# EasyEDA Pro project 编码电子锁.eprj

# Schematic Schematic1
Create Date: 2025-03-08; Page Name: P1; Project Name: 编码电子锁; Schematic Name: Schematic1; Update Date: 2025-03-08; Company: 嘉立创EDA; Page Size: A4; Version: V1.0
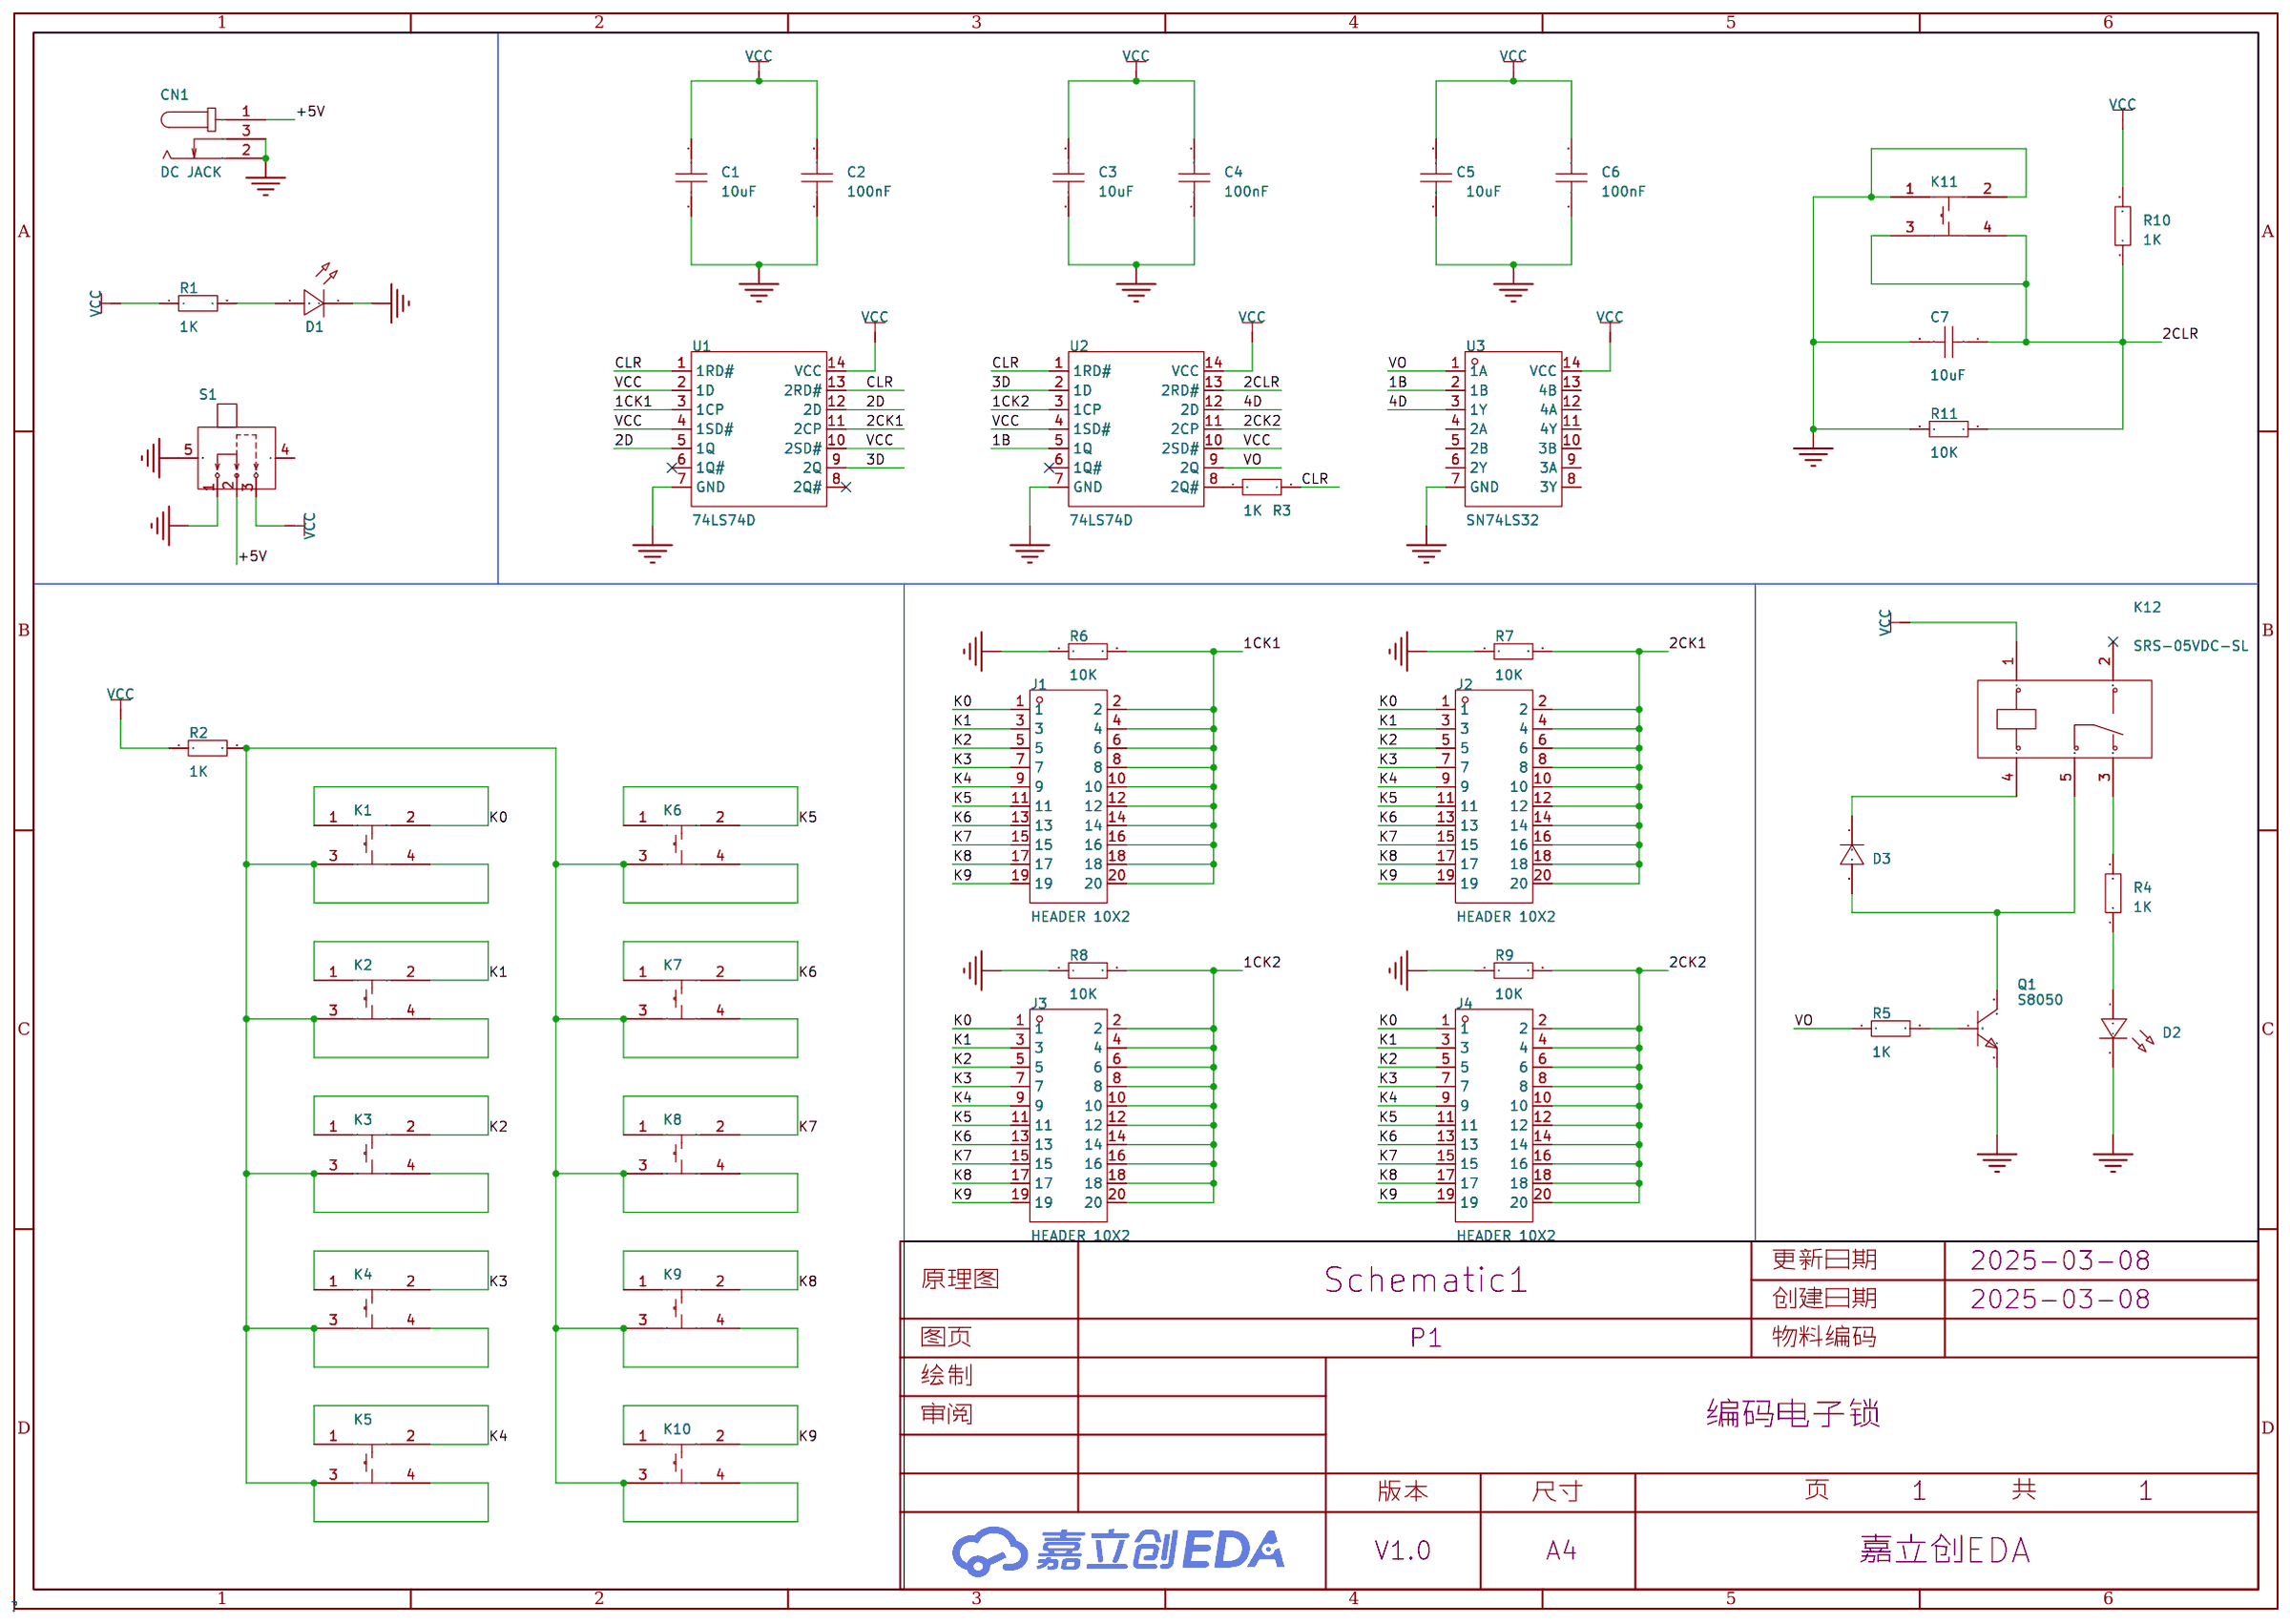
[diagram p0: schematic sheet]

## Parts
C1  10uF  [C0805]
C2  100nF  [C0805]
C3  10uF  [C0805]
C4  100nF  [C0805]
C5  10uF  [C0805]
C6  100nF  [C0805]
C7  10uF  [C0805]
CN1  DC JACK  [DC-IN-TH_DC005]
D1  -  [LED_TH-3mm]
D2  -  [LED_TH-3mm]
D3  LL4148-GS08  [SOD-80_L3.5-W1.5-RD]
J1  HEADER 10X2  [HDR-TH_20P-P2.54-V-M-R2-C10-S2.54]
J2  HEADER 10X2  [HDR-TH_20P-P2.54-V-M-R2-C10-S2.54]
J3  HEADER 10X2  [HDR-TH_20P-P2.54-V-M-R2-C10-S2.54]
J4  HEADER 10X2  [HDR-TH_20P-P2.54-V-M-R2-C10-S2.54]
K1  TS-1002S-04526C  [SW-SMD_4P-L6.0-W6.0-P4.50-LS9.0-2]
K2  TS-1002S-04526C  [SW-SMD_4P-L6.0-W6.0-P4.50-LS9.0-2]
K3  TS-1002S-04526C  [SW-SMD_4P-L6.0-W6.0-P4.50-LS9.0-2]
K4  TS-1002S-04526C  [SW-SMD_4P-L6.0-W6.0-P4.50-LS9.0-2]
K5  TS-1002S-04526C  [SW-SMD_4P-L6.0-W6.0-P4.50-LS9.0-2]
K6  TS-1002S-04526C  [SW-SMD_4P-L6.0-W6.0-P4.50-LS9.0-2]
K7  TS-1002S-04526C  [SW-SMD_4P-L6.0-W6.0-P4.50-LS9.0-2]
K8  TS-1002S-04526C  [SW-SMD_4P-L6.0-W6.0-P4.50-LS9.0-2]
K9  TS-1002S-04526C  [SW-SMD_4P-L6.0-W6.0-P4.50-LS9.0-2]
K10  TS-1002S-04526C  [SW-SMD_4P-L6.0-W6.0-P4.50-LS9.0-2]
K11  TS-1002S-04526C  [SW-SMD_4P-L6.0-W6.0-P4.50-LS9.0-2]
K12  SRS-05VDC-SL  [RELAY-TH_SRD-XXVDC-XL-C]
Q1  S8050  [SOT-23-3_L3.0-W1.7-P0.95-LS2.9-BR]
R1  1K  [R0805]
R2  1K  [R0805]
R3  1K  [R0805]
R4  1K  [R0805]
R5  1K  [R0805]
R6  10K  [R0805]
R7  10K  [R0805]
R8  10K  [R0805]
R9  10K  [R0805]
R10  1K  [R0805]
R11  10K  [R0805]
S1  SS12F44G5  [SW-TH_SHOU-HAN_SS12F44G4]
U1  74LS74D  [DIP-14_L19.1-W6.4-P2.54-LS7.6-BL]
U2  74LS74D  [DIP-14_L19.1-W6.4-P2.54-LS7.6-BL]
U3  SN74LS32  [PDIP-14_L19.6-W6.5-P2.54-LS7.9-BL]

## Library data of the parts
C1-C7 = CAP_0805: Supplier Footprint: 0805
CN1 = DC005: 连接器类型:DC电源插座;安装方式:弯插;触点内径:2mm;触点外径:6.3mm;额定电流:500mA;额定电压:30V;工作温度范围:-25℃~+70℃;; LCSC Part Name: DC电源插座 内径:2mm 外径:6.3mm; Supplier Part: C431533; Manufacturer: SHOU HAN(首韩); Supplier Footprint: 插件; Datasheet: https://atta.szlcsc.com/upload/public/pdf/source/20190925/C431533_4751811035784AC1D38EBC85F7905E99.pdf; Supplier: LCSC; Connector Type: DC电源插座; Mounting Style: 弯插; Inside Contact Diameter: 2mm; Outside Contact Diameter: 6.3mm; Current Rating (Max): 500mA; Voltage Rating (Max): 30V; Operating Temperature Range: -25℃~+70℃
D1 D2 = LED_TH-R_3mm: Supplier Footprint: 插件
D3 = LL4148-GS08: 二极管配置:-;正向压降(Vf):860mV@50mA;直流反向耐压(Vr):75V;平均整流电流(Io):300mA;功率:500mW;反向恢复时间(trr):8ns;; LCSC Part Name: 电压:75V 电流:300mA; Supplier Part: C68883; Manufacturer: VISHAY(威世); Supplier Footprint: MiniMELF; Datasheet: https://atta.szlcsc.com/upload/public/pdf/source/20160803/1470206543327.pdf; Supplier: LCSC; Forward Voltage (Vf@If): 860mV@50mA; Reverse Voltage (Vr): 75V; Average Rectified Current (Io): 300mA; Power Dissipation: 500mW; Reverse Leakage Current: 5uA@75V; Reverse Recovery Time (trr): 8ns
J1-J4 = 2.54-2*10: 插针结构:2x10P;间距:2.54mm;排数:双排;总PIN位数:20P;; Supplier Part: C5116480; Manufacturer: ZHOURI(洲日); Supplier Footprint: 插件,P=2.54mm; Datasheet: https://atta.szlcsc.com/upload/public/pdf/source/20220412/C6BEA3D643D1CE07163CD717B50927E0.pdf; Supplier: LCSC; Pin Structure: 2x10P; Pitch: 2.54mm; Number of Rows: 双排; Number of Pins: 20P
K1-K11 = TS-1002S-04526C: 电路结构:单刀单掷;按钮形状:圆形按钮;安装方式:立贴;开关长度:6mm;开关宽度:6mm;开关高度:4.5mm;触点电流:50mA;额定电压(DC):12V;带灯:-;机械寿命:-;; LCSC Part Name: 6*6*4.5mm 立贴 轻触开关; Supplier Part: C455109; Manufacturer: XUNPU(讯普); Supplier Footprint: SMD,6x6mm; Datasheet: https://atta.szlcsc.com/upload/public/pdf/source/20191118/C455126_F61E8FA1ED640FB1CE0B30B55DEB62E3.pdf; Supplier: LCSC; Circuit: 单刀单掷; Actuator Style: 圆形按钮; Mounting Style: 立贴; Switch Length: 6mm; Switch Width: 6mm; Switch Height: 4.5mm; Contact Current: 50mA; Voltage Rating (DC): 12V
K12 = SRD-05VDC-SL-C: 线圈电压:5V;触点形式:一组转换:1C(单刀双掷-转换);触点容量(电阻负载):-;最大切换电压:250V@AC;最大切换电流:15A;; LCSC Part Name: 蓝色; Supplier Part: C35449; Manufacturer: 松乐; Supplier Footprint: 插件,15.6x19.2mm; Datasheet: https://atta.szlcsc.com/upload/public/pdf/source/20200305/C490149_C96E4098A3B1FFB377D5AD2E40B7C2A8.pdf; Supplier: LCSC; Coil Voltage: 5V; Contact Form: 一组转换:1C(单刀双掷-转换); Pin Number: 5; Maximum Switching Voltage: 250V@AC; Coil Rated Power: 360mW; Maximum Switching Current: 15A; Coil Type: 无极性-单线圈; Coil Resistance: 70Ω; Contact Resistance: 100mΩ; Operate Time: 10ms; Release Time: 10ms
Q1 = S8050-J3Y: 晶体管类型:NPN;集电极电流(Ic):500mA;集射极击穿电压(Vceo):25V;耗散功率(Pd):300mW;直流电流增益(hFE):120@500mA,1V;; Supplier Part: C364312; Manufacturer: MDD(辰达半导体); Supplier Footprint: SOT-23; Datasheet: https://atta.szlcsc.com/upload/public/pdf/source/20241121/97BBBA232BCC69760BB5FA02C7A73959.pdf; Supplier: LCSC; type: NPN; Current - Collector(Ic): 500mA; Collector - Emitter Voltage VCEO: 25V; Pd - Power Dissipation: 300mW; DC Current Gain: 120@500mA,1V; Transition frequency(fT): 150MHz; Current - Collector Cutoff: 100nA; Vce Saturation(VCE(sat)): 600mV; Operating Temperature: -55℃~+150℃
R1-R11 = Res_0805: Supplier Footprint: 0805
S1 = SS12F44G5: 拨动开关 立式直脚插件 二档 柄高5mm; Supplier Part: C22435641; Manufacturer: HanElectricity(瀚源); Supplier Footprint: 插件-5P,12.2x5.5mm; Datasheet: https://atta.szlcsc.com/upload/public/pdf/source/20240521/251CCE5309E68669C05257185F219EB8.pdf; Supplier: LCSC
U1 U2 = SN74LS74N: 类型:D-型;工作电压:2V~6V;时钟频率(fc):82MHz;元件数:2;每个元件位数:1;静态电流(Iq):40uA;; Supplier Part: C22466308; Manufacturer: LX(灵星芯微); Supplier Footprint: DIP-14; Datasheet: https://atta.szlcsc.com/upload/public/pdf/source/20240614/A3AE1E265392141761706CE1278B9875.pdf; Supplier: LCSC; Type: D-型; Trigger Type: 上升沿; Voltage - Supply: 2V~6V; Clock Frequency: 82MHz; Function: 置位和复位; Number of Elements: 2; Number of Bits per Element: 1; Output Type: 互补型; Series: 74LS系列; Current - Output Low(IOL): 5.2mA; Current - Output High(IOH): 5.2mA; Quiescent Current: 40uA; Operating Temperature: -40℃~+125℃
U3 = SN74LS32N: 逻辑类型:或门;通道数:4;电源电压:4.75V~5.25V;最大传播延迟:22ns@5V,15pF;; Supplier Part: C273644; Manufacturer: TI(德州仪器); Supplier Footprint: PDIP-14; Datasheet: https://www.ti.com/cn/lit/gpn/sn74ls32; Supplier: LCSC; Logic Gate Type: 或门; Number of Channels: 4; Supply Voltage: 4.75V~5.25V; Sink Current: 8mA; Source Current: 400uA; High Level Range (VIH): 2V; Low Level Range (VIL): 800mV; Series: 74LS系列; Propagation Delay Time: 22ns@5V,15pF; Operating Temperature: 0℃~+70℃

## Nets
+5V: CN1.1 S1.2
GND: C1.1 C2.1 C3.1 C4.1 C5.1 C6.1 C7.2 CN1.2 CN1.3 D1.2(A) D2.2(A) K11.1 K11.2 Q1.2(E) R6.1 R7.1 R8.1 R9.1 R11.2 S1.1 S1.5 U1.7(GND) U2.7(GND) U3.7(GND)
VCC: C1.2 C2.2 C3.2 C4.2 C5.2 C6.2 K12.1 R1.1 R2.1 R10.2 S1.3 U1.2(1D) U1.4(1SD#) U1.10(2SD#) U1.14(VCC) U2.4(1SD#) U2.10(2SD#) U2.14(VCC) U3.14(VCC)
1B: U2.5(1Q) U3.2(1B)
1CK1: J1.2 J1.4 J1.6 J1.8 J1.10 J1.12 J1.14 J1.16 J1.18 J1.20 R6.2 U1.3(1CP)
1CK2: J3.2 J3.4 J3.6 J3.8 J3.10 J3.12 J3.14 J3.16 J3.18 J3.20 R8.2 U2.3(1CP)
2CK1: J2.2 J2.4 J2.6 J2.8 J2.10 J2.12 J2.14 J2.16 J2.18 J2.20 R7.2 U1.11(2CP)
2CK2: J4.2 J4.4 J4.6 J4.8 J4.10 J4.12 J4.14 J4.16 J4.18 J4.20 R9.2 U2.11(2CP)
2CLR: C7.1 K11.3 K11.4 R10.1 R11.1 U2.13(2RD#)
2D: U1.5(1Q) U1.12(2D)
3D: U1.9(2Q) U2.2(1D)
4D: U2.12(2D) U3.3(1Y)
CLR: R3.2 U1.1(1RD#) U1.13(2RD#) U2.1(1RD#)
K0: J1.1 J2.1 J3.1 J4.1 K1.1 K1.2
K1: J1.3 J2.3 J3.3 J4.3 K2.1 K2.2
K2: J1.5 J2.5 J3.5 J4.5 K3.1 K3.2
K3: J1.7 J2.7 J3.7 J4.7 K4.1 K4.2
K4: J1.9 J2.9 J3.9 J4.9 K5.1 K5.2
K5: J1.11 J2.11 J3.11 J4.11 K6.1 K6.2
K6: J1.13 J2.13 J3.13 J4.13 K7.1 K7.2
K7: J1.15 J2.15 J3.15 J4.15 K8.1 K8.2
K8: J1.17 J2.17 J3.17 J4.17 K9.1 K9.2
K9: J1.19 J2.19 J3.19 J4.19 K10.1 K10.2
VO: R5.1 U2.9(2Q) U3.1(1A)
$1N2580: D1.1(C) R1.2
$1N2943: R3.1 U2.8(2Q#)
$1N4176: K1.3 K1.4 K2.3 K2.4 K3.3 K3.4 K4.3 K4.4 K5.3 K5.4 K6.3 K6.4 K7.3 K7.4 K8.3 K8.4 K9.3 K9.4 K10.3 K10.4 R2.2
$1N5266: Q1.1(B) R5.2
$1N5277: D2.1(C) R4.1
$1N5285: K12.3 R4.2
$1N5293: D3.1(C) K12.4
$1N5296: D3.2(A) K12.5 Q1.3(C)

Not connected (* = marked no-connect by the designer): K12 2*; S1 4; U1 6(1Q#)* 8(2Q#)*; U2 6(1Q#)*; U3 4(2A) 5(2B) 6(2Y) 8(3Y) 9(3A) 10(3B) 11(4Y) 12(4A) 13(4B)

# Board PCB1
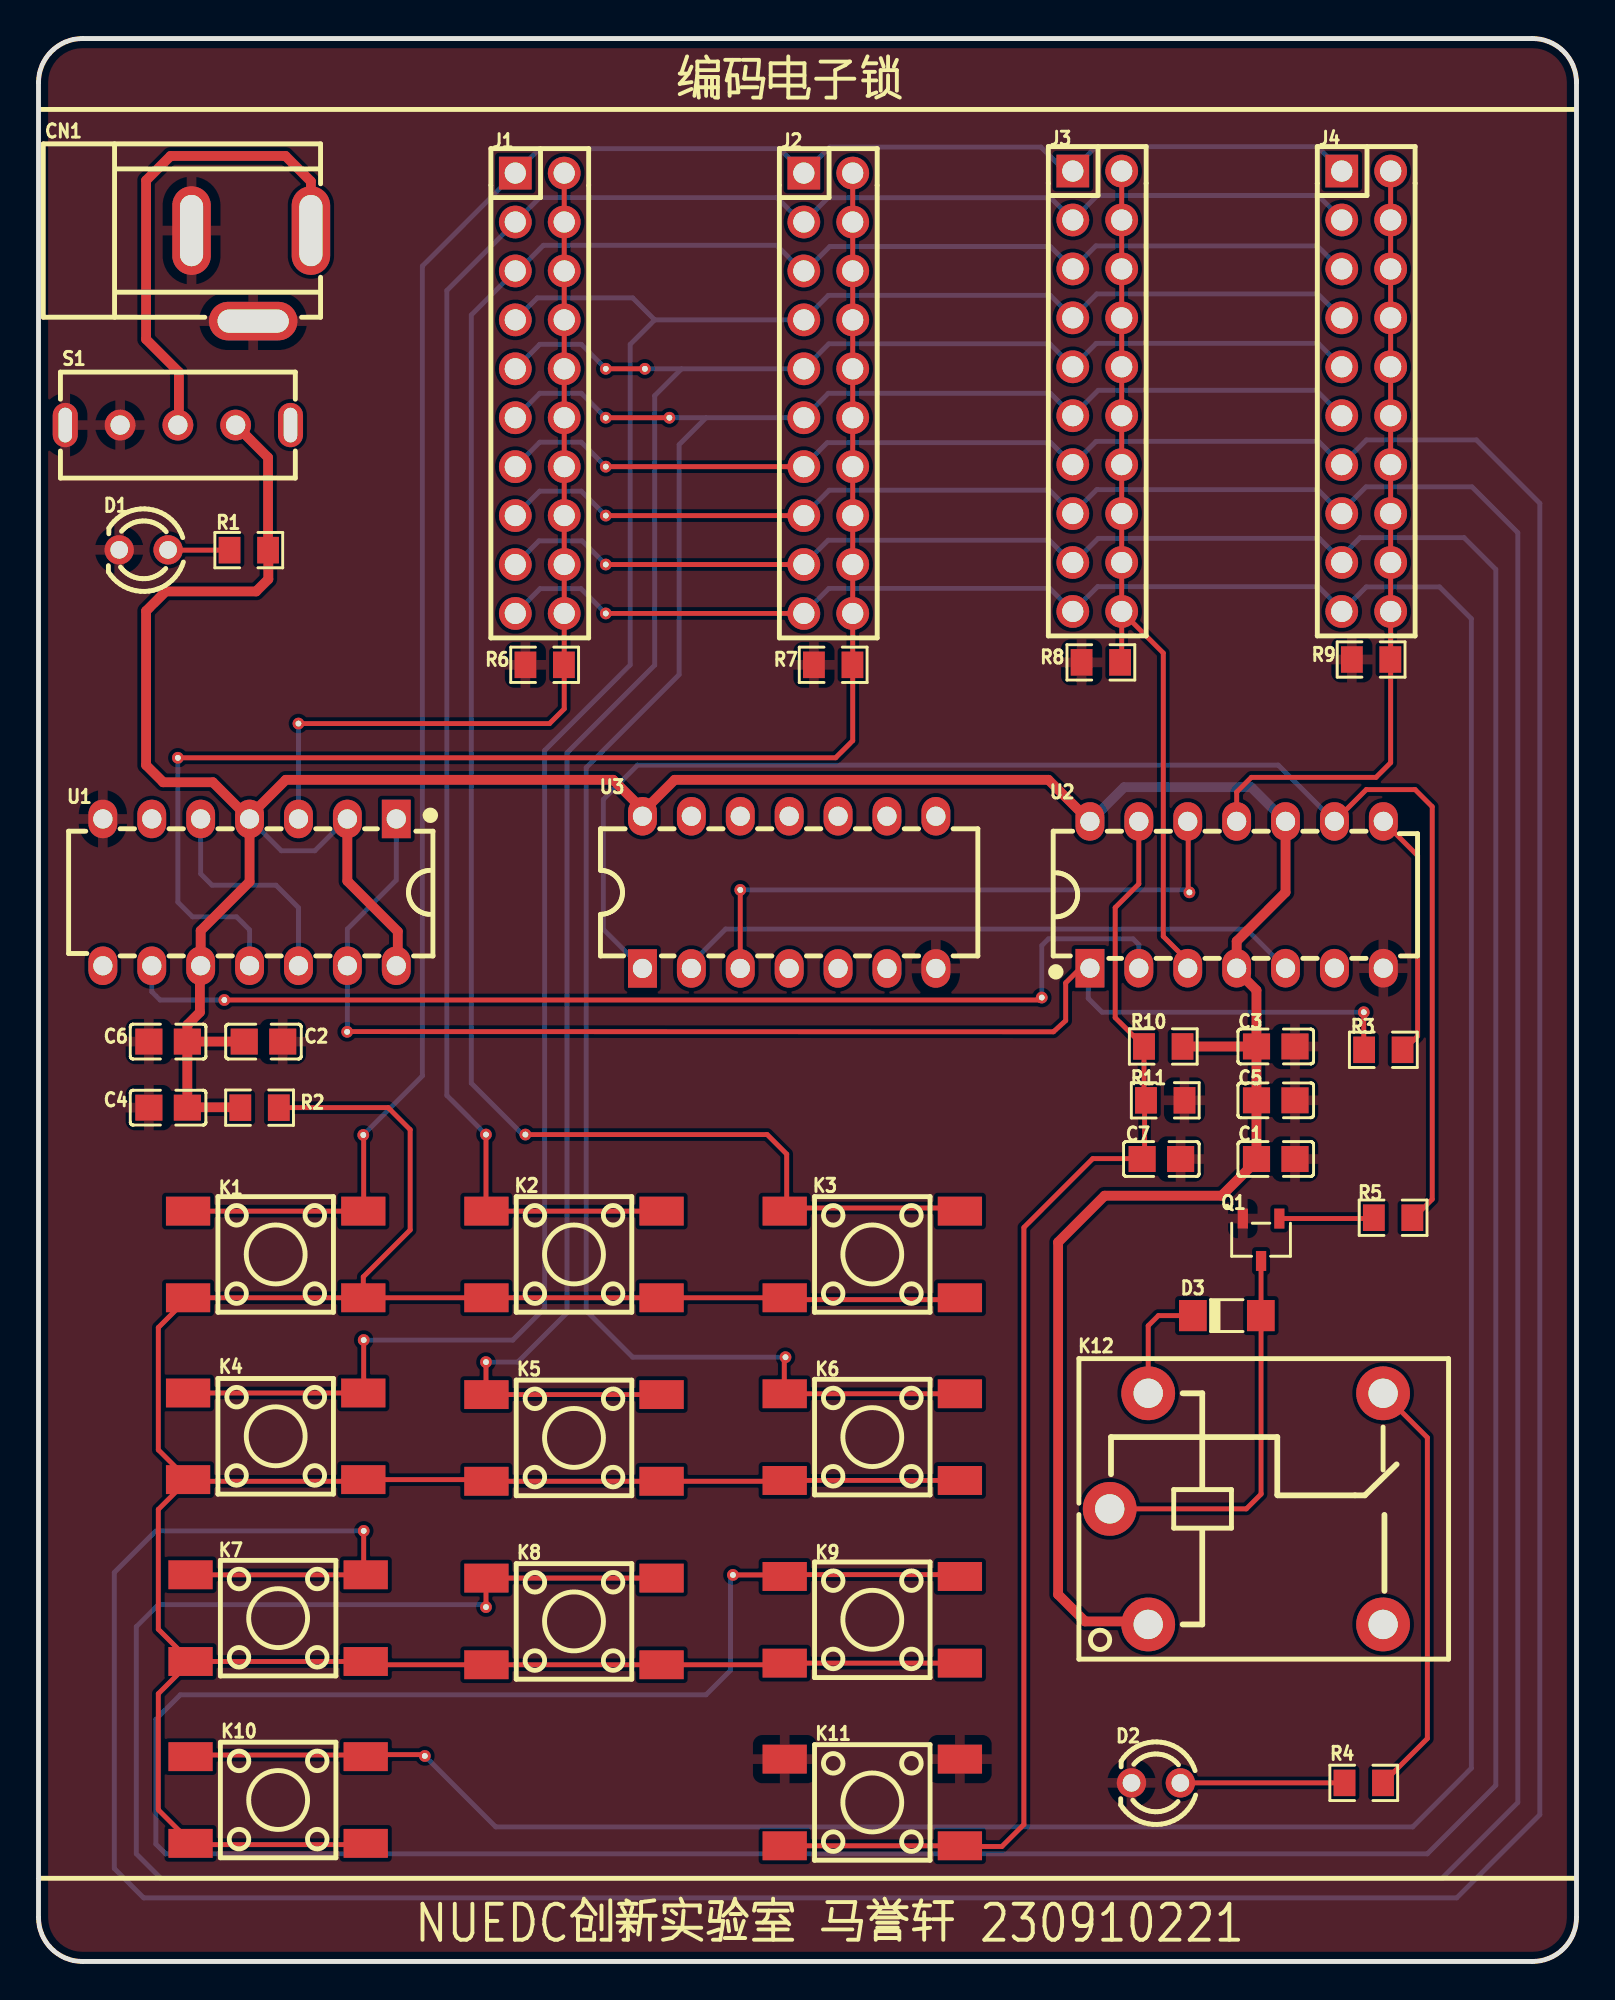
[diagram p1: board, top side]
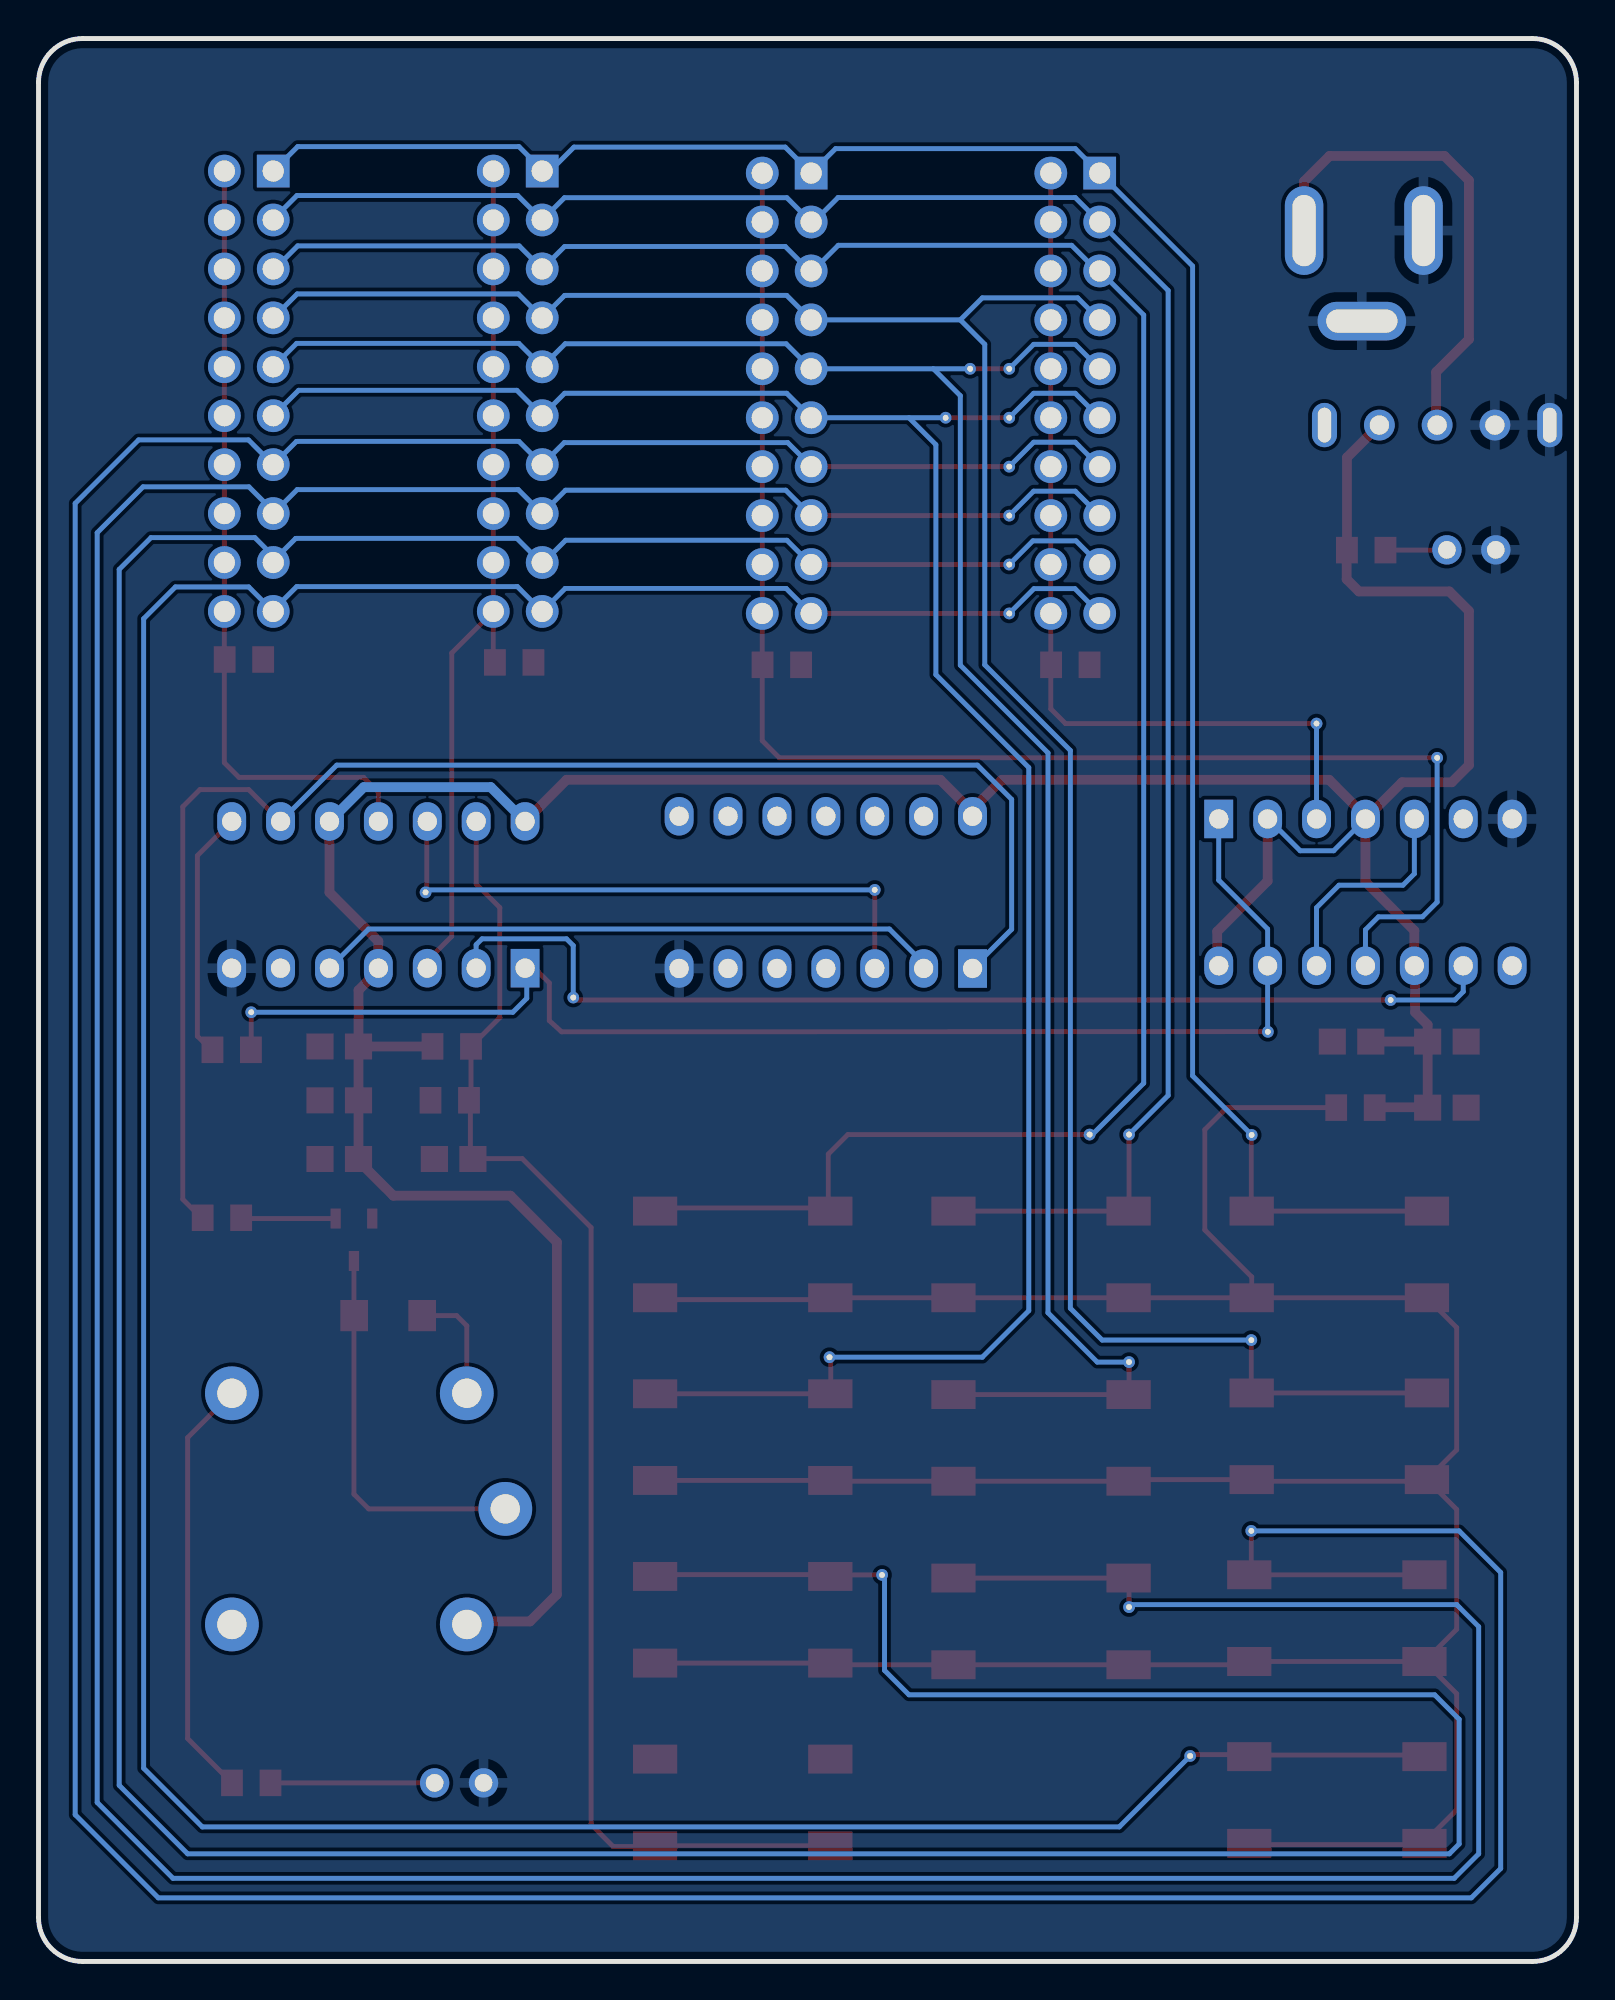
[diagram p2: board, bottom side, seen from below]

Outline 79.88 x 99.82 mm; copper layers: Top Layer, Bottom Layer. Coordinates in mm from the lower left corner of the outline.
Outline path: 0,97.54 0,2.29 arc(0.67,0.67) 2.29,0 77.6,0 arc(79.21,0.67) 79.88,2.29 79.88,97.6 ; 0,97.54 arc(0.67,99.15) 2.29,99.82 77.59,99.82 arc(79.21,99.15) 79.88,97.54 ; 0,97.54 arc(0,97.53) 0,97.53
Stack: Top Layer 0.035mm / Dielectric1 1.51mm FR4 er 4.5 / Bottom Layer 0.035mm

## Design rules (mm)
template: 自定义配置
spacing copperThickness1oz (default): track to track 0.102, other pairs 0.152 to 0.3
spacing copperThickness2oz: track to track 0.203, other pairs 0.152 to 0.3
track width copperThickness1oz (default): min 0.127, default 0.305, max 2.54
track width copperThickness2oz: min 0.203, default 0.305, max 2.54
differential pair differentialPair (default): width min 0.127, default 0.254, max 2.54; gap min 0.152, default 0.152
via viaSize (default): diameter min 0.5, default 0.61, max 10; hole min 0.3, default 0.305, max 6.299

## Placement (name value [footprint] x y rotation side)
C1  10uF  [C0805]  64.26 41.66 180 top
C2  100nF  [C0805]  11.68 47.75 180 top
C3  10uF  [C0805]  64.26 47.5 180 top
C4  100nF  [C0805]  6.73 44.32 0 top
C5  10uF  [C0805]  64.26 44.7 180 top
C6  100nF  [C0805]  6.73 47.75 0 top
C7  10uF  [C0805]  58.32 41.66 0 top
CN1  DC JACK  [DC-IN-TH_DC005]  11.05 87.5 0 top
D1  -  [LED_TH-3mm]  5.46 73.28 180 top
D2  -  [LED_TH-3mm]  58.04 9.27 180 top
D3  LL4148-GS08  [SOD-80_L3.5-W1.5-RD]  61.72 33.53 0 top
J1  HEADER 10X2  [HDR-TH_20P-P2.54-V-M-R2-C10-S2.54]  26.04 81.41 270 top
J2  HEADER 10X2  [HDR-TH_20P-P2.54-V-M-R2-C10-S2.54]  41.02 81.41 270 top
J3  HEADER 10X2  [HDR-TH_20P-P2.54-V-M-R2-C10-S2.54]  54.99 81.51 270 top
J4  HEADER 10X2  [HDR-TH_20P-P2.54-V-M-R2-C10-S2.54]  68.96 81.51 270 top
K1  TS-1002S-04526C  [SW-SMD_4P-L6.0-W6.0-P4.50-LS9.0-2]  12.32 36.7 0 top
K2  TS-1002S-04526C  [SW-SMD_4P-L6.0-W6.0-P4.50-LS9.0-2]  27.81 36.7 0 top
K3  TS-1002S-04526C  [SW-SMD_4P-L6.0-W6.0-P4.50-LS9.0-2]  43.31 36.7 0 top
K4  TS-1002S-04526C  [SW-SMD_4P-L6.0-W6.0-P4.50-LS9.0-2]  12.32 27.26 0 top
K5  TS-1002S-04526C  [SW-SMD_4P-L6.0-W6.0-P4.50-LS9.0-2]  27.81 27.18 0 top
K6  TS-1002S-04526C  [SW-SMD_4P-L6.0-W6.0-P4.50-LS9.0-2]  43.31 27.22 0 top
K7  TS-1002S-04526C  [SW-SMD_4P-L6.0-W6.0-P4.50-LS9.0-2]  12.45 17.82 0 top
K8  TS-1002S-04526C  [SW-SMD_4P-L6.0-W6.0-P4.50-LS9.0-2]  27.81 17.65 0 top
K9  TS-1002S-04526C  [SW-SMD_4P-L6.0-W6.0-P4.50-LS9.0-2]  43.31 17.74 0 top
K10  TS-1002S-04526C  [SW-SMD_4P-L6.0-W6.0-P4.50-LS9.0-2]  12.45 8.38 0 top
K11  TS-1002S-04526C  [SW-SMD_4P-L6.0-W6.0-P4.50-LS9.0-2]  43.31 8.25 0 top
K12  SRS-05VDC-SL  [RELAY-TH_SRD-XXVDC-XL-C]  62.74 23.5 0 top
NOREF  -  [Pad_e135]  9.65 49.91 0 top
NOREF#2  -  [Pad_e161]  59.78 55.5 0 top
NOREF#3  -  [Pad_e240]  38.8 31.37 0 top
NOREF#4  -  [Pad_e198]  25.29 42.93 0 top
NOREF#5  -  [Pad_e235]  23.24 31.11 0 top
NOREF#6  -  [Pad_e275]  32.77 80.14 0 top
NOREF#7  -  [Pad_e296]  16.89 22.35 0 top
NOREF#8  -  [Pad_e136]  52.11 50.04 0 top
NOREF#9  -  [Pad_e194]  23.24 42.93 0 top
NOREF#10  -  [Pad_e190]  16.87 42.9 0 top
NOREF#11  -  [Pad_e274]  31.5 82.68 0 top
NOREF#12  -  [Pad_e569]  7.24 62.48 0 top
NOREF#13  -  [Pad_e309]  20.07 10.67 0 top
NOREF#14  -  [Pad_e261]  29.46 72.52 0 top
NOREF#15  -  [Pad_e265]  29.46 82.68 0 top
NOREF#16  -  [Pad_e262]  29.46 69.98 0 top
NOREF#17  -  [Pad_e258]  29.46 77.6 0 top
NOREF#18  -  [Pad_e160]  36.45 55.63 0 top
NOREF#19  -  [Pad_e304]  36.07 20.07 0 top
NOREF#20  -  [Pad_e565]  68.83 49.28 0 top
NOREF#21  -  [Pad_e174]  16.03 48.26 0 top
NOREF#22  -  [Pad_e260]  29.46 75.06 0 top
NOREF#23  -  [Pad_e266]  29.46 80.14 0 top
NOREF#24  -  [Pad_e300]  23.24 18.4 0 top
NOREF#25  -  [Pad_e237]  16.89 32.26 0 top
NOREF#26  -  [Pad_e148]  13.5 64.26 0 top
Q1  S8050  [SOT-23-3_L3.0-W1.7-P0.95-LS2.9-BR]  63.5 37.47 90 top
R1  1K  [R0805]  10.92 73.26 180 top
R2  1K  [R0805]  11.48 44.32 0 top
R3  1K  [R0805]  69.85 47.33 180 top
R4  1K  [R0805]  68.83 9.27 0 top
R5  1K  [R0805]  70.36 38.61 180 top
R6  10K  [R0805]  26.29 67.31 0 top
R7  10K  [R0805]  41.28 67.31 0 top
R8  10K  [R0805]  55.18 67.44 0 top
R9  10K  [R0805]  69.22 67.59 0 top
R10  1K  [R0805]  58.42 47.5 0 top
R11  10K  [R0805]  58.52 44.7 0 top
S1  SS12F44G5  [SW-TH_SHOU-HAN_SS12F44G4]  7.24 79.76 0 top
U1  74LS74D  [DIP-14_L19.1-W6.4-P2.54-LS7.6-BL]  10.96 55.5 180 top
U2  74LS74D  [DIP-14_L19.1-W6.4-P2.54-LS7.6-BL]  62.23 55.37 0 top
U3  SN74LS32  [PDIP-14_L19.6-W6.5-P2.54-LS7.9-BL]  38.99 55.5 0 top

## Footprints (pads in the part's own frame, mm; a bottom-side part is the same pattern mirrored in y, then rotated)
C0805
  rect 1.41x1.35 smd: 1(-1,0) 2(1,0)
DC-IN-TH_DC005
  oval 2x4.6 hole 1.2x3.7: 1(3.1,2.35) 2(-3.1,2.35)
  oval 4.6x2 hole 3.7x1.2: 3(0.1,-2.35)
DIP-14_L19.1-W6.4-P2.54-LS7.6-BL
  rect 1.5x2 hole 1: 1(-7.62,-3.81)
  oval 1.5x2 hole 1: 2(-5.08,-3.81) 3(-2.54,-3.81) 4(0,-3.81) 5(2.54,-3.81) 6(5.08,-3.81) 7(7.62,-3.81) 8(7.62,3.81) 9(5.08,3.81) 10(2.54,3.81) 11(0,3.81) 12(-2.54,3.81) 13(-5.08,3.81) 14(-7.62,3.81)
HDR-TH_20P-P2.54-V-M-R2-C10-S2.54
  rect 1.7x1.7 hole 1.1: 1(-11.43,-1.27)
  round 1.7 hole 1.1: 2(-11.43,1.27) 3(-8.89,-1.27) 4(-8.89,1.27) 5(-6.35,-1.27) 6(-6.35,1.27) 7(-3.81,-1.27) 8(-3.81,1.27) 9(-1.27,-1.27) 10(-1.27,1.27) 11(1.27,-1.27) 12(1.27,1.27) 13(3.81,-1.27) 14(3.81,1.27) 15(6.35,-1.27) 16(6.35,1.27) 17(8.89,-1.27) 18(8.89,1.27) 19(11.43,-1.27) 20(11.43,1.27)
LED_TH-3mm
  round 1.524 hole 0.914: 1(-1.27,0) 2(1.27,0)
Pad_e135
  round 0.61 hole 0.305: 22(0,0)
Pad_e136
  round 0.61 hole 0.305: 23(0,0)
Pad_e148
  round 0.61 hole 0.305: 25(0,0)
Pad_e160
  round 0.61 hole 0.305: 26(0,0)
Pad_e161
  round 0.61 hole 0.305: 27(0,0)
Pad_e174
  round 0.61 hole 0.305: 28(0,0)
Pad_e190
  round 0.61 hole 0.305: 29(0,0)
Pad_e194
  round 0.61 hole 0.305: 30(0,0)
Pad_e198
  round 0.61 hole 0.305: 31(0,0)
Pad_e235
  round 0.61 hole 0.305: 32(0,0)
Pad_e237
  round 0.61 hole 0.305: 33(0,0)
Pad_e240
  round 0.61 hole 0.305: 34(0,0)
Pad_e258
  round 0.61 hole 0.305: 35(0,0)
Pad_e260
  round 0.61 hole 0.305: 36(0,0)
Pad_e261
  round 0.61 hole 0.305: 37(0,0)
Pad_e262
  round 0.61 hole 0.305: 38(0,0)
Pad_e265
  round 0.61 hole 0.305: 39(0,0)
Pad_e266
  round 0.61 hole 0.305: 40(0,0)
Pad_e274
  round 0.61 hole 0.305: 41(0,0)
Pad_e275
  round 0.61 hole 0.305: 42(0,0)
Pad_e296
  round 0.61 hole 0.305: 21(0,0)
Pad_e300
  round 0.61 hole 0.305: 43(0,0)
Pad_e304
  round 0.61 hole 0.305: 44(0,0)
Pad_e309
  round 0.61 hole 0.305: 45(0,0)
Pad_e565
  round 0.61 hole 0.305: 46(0,0)
Pad_e569
  round 0.61 hole 0.305: 24(0,0)
PDIP-14_L19.6-W6.5-P2.54-LS7.9-BL
  rect 1.5x2 hole 1: 1(-7.62,-3.95)
  oval 1.5x2 hole 1: 2(-5.08,-3.95) 3(-2.54,-3.95) 4(0,-3.95) 5(2.54,-3.95) 6(5.08,-3.95) 7(7.62,-3.95) 8(7.62,3.95) 9(5.08,3.95) 10(2.54,3.95) 11(0,3.95) 12(-2.54,3.95) 13(-5.08,3.95) 14(-7.62,3.95)
R0805
  rect 1.133x1.377 smd: 1(-1,0) 2(1,0)
RELAY-TH_SRD-XXVDC-XL-C
  round 2.794 hole 1.524: 1(-5.1,-6) 2(7.1,-6) 3(7.1,6) 4(-5.1,6) 5(-7.1,0)
SOD-80_L3.5-W1.5-RD
  rect 1.44x1.62 smd: 1(-1.765,0) 2(1.765,0)
SOT-23-3_L3.0-W1.7-P0.95-LS2.9-BR
  rect 1.038x0.532 smd: 1(1.101,-0.95) 2(1.101,0.95) 3(-1.101,0)
SW-SMD_4P-L6.0-W6.0-P4.50-LS9.0-2
  rect 2.3x1.5 smd: 1(-4.55,2.25) 2(4.55,2.25) 3(-4.55,-2.25) 4(4.55,-2.25)
SW-TH_SHOU-HAN_SS12F44G4
  round 1.6 hole 1: 1(-3,0) 2(0,0) 3(3,0)
  oval 1.3x2.3 hole 0.7x1.8: 4(5.85,0) 5(-5.85,0)

## Nets
+5V: CN1.1 S1.2
GND: C1.1 C2.1 C3.1 C4.1 C5.1 C6.1 C7.2 CN1.2 CN1.3 D1.2 D2.2 K11.1 K11.2 Q1.2 R6.1 R7.1 R8.1 R9.1 R11.2 S1.1 S1.5 U1.7 U2.7 U3.7
VCC: C1.2 C2.2 C3.2 C4.2 C5.2 C6.2 K12.1 R1.1 R2.1 R10.2 S1.3 U1.2 U1.4 U1.10 U1.14 U2.4 U2.10 U2.14 U3.14
1B: U2.5 U3.2
1CK1: J1.2 J1.4 J1.6 J1.8 J1.10 J1.12 J1.14 J1.16 J1.18 J1.20 NOREF#26.25 R6.2 U1.3
1CK2: J3.2 J3.4 J3.6 J3.8 J3.10 J3.12 J3.14 J3.16 J3.18 J3.20 R8.2 U2.3
2CK1: J2.2 J2.4 J2.6 J2.8 J2.10 J2.12 J2.14 J2.16 J2.18 J2.20 NOREF#12.24 R7.2 U1.11
2CK2: J4.2 J4.4 J4.6 J4.8 J4.10 J4.12 J4.14 J4.16 J4.18 J4.20 R9.2 U2.11
2CLR: C7.1 K11.3 K11.4 R10.1 R11.1 U2.13
2D: U1.5 U1.12
3D: NOREF.22 NOREF#8.23 U1.9 U2.2
4D: NOREF#2.27 NOREF#18.26 U2.12 U3.3
CLR: NOREF#20.46 NOREF#21.28 R3.2 U1.1 U1.13 U2.1
K0: J1.1 J2.1 J3.1 J4.1 K1.1 K1.2 NOREF#10.29
K1: J1.3 J2.3 J3.3 J4.3 K2.1 K2.2 NOREF#9.30
K2: J1.5 J2.5 J3.5 J4.5 K3.1 K3.2 NOREF#4.31
K3: J1.7 J2.7 J3.7 J4.7 K4.1 K4.2 NOREF#25.33
K4: J1.9 J2.9 J3.9 J4.9 K5.1 K5.2 NOREF#5.32 NOREF#11.41 NOREF#15.39
K5: J1.11 J2.11 J3.11 J4.11 K6.1 K6.2 NOREF#3.34 NOREF#6.42 NOREF#23.40
K6: J1.13 J2.13 J3.13 J4.13 K7.1 K7.2 NOREF#7.21 NOREF#17.35
K7: J1.15 J2.15 J3.15 J4.15 K8.1 K8.2 NOREF#22.36 NOREF#24.43
K8: J1.17 J2.17 J3.17 J4.17 K9.1 K9.2 NOREF#14.37 NOREF#19.44
K9: J1.19 J2.19 J3.19 J4.19 K10.1 K10.2 NOREF#13.45 NOREF#16.38
VO: R5.1 U2.9 U3.1
$1N2580: D1.1 R1.2
$1N2943: R3.1 U2.8
$1N4176: K1.3 K1.4 K2.3 K2.4 K3.3 K3.4 K4.3 K4.4 K5.3 K5.4 K6.3 K6.4 K7.3 K7.4 K8.3 K8.4 K9.3 K9.4 K10.3 K10.4 R2.2
$1N5266: Q1.1 R5.2
$1N5277: D2.1 R4.1
$1N5285: K12.3 R4.2
$1N5293: D3.1 K12.4
$1N5296: D3.2 K12.5 Q1.3

Pads without a net: K12 2; S1 4; U1 6 8; U2 6; U3 4 5 6 8 9 10 11 12 13

## Routing (per net, layer and track width the routed paths; a pad name or vN(x,y) marks a point on that pad's centre or on a via; arc(x,y) is an arc through that point)
+5V: length 25.6
  Top Layer w0.508: S1.2 7.29,79.81 7.29,82.51 5.59,84.21 5.59,92.46 6.86,93.73 12.83,93.73 14.15,92.4 CN1.1
VCC: length 184.4
  Top Layer w0.508: C6.2 7.73,48.62 8.38,49.28 8.38,51.65 U1.10 ; C6.2 C4.2 ; C6.2 10.58,47.75 ; 7.73,44.34 10.39,44.34 10.41,44.32 ; 8.37,51.63 U1.10 ; U1.10 8.42,53.51 10.96,56.05 U1.4 9.06,61.21 6.48,61.21 5.59,62.1 5.59,70.1 6.6,71.12 11.3,71.12 11.94,71.75 11.94,73.15 ; S1.3 11.92,78.07 R1.1 ; 10.96,59.46 12.84,61.34 29.85,61.34 31.37,59.82 31.37,59.52 ; U1.2 16.04,56.09 18.66,53.47 18.66,51.69 ; 31.37,59.67 33.04,61.34 52.45,61.34 54.61,59.18 ; 57.64,17.5 57.48,17.65 54.36,17.65 52.96,19.05 52.96,37.34 55.37,39.75 61.45,39.75 63.26,41.56 C3.2 ; 59.5,47.5 C3.2 ; C3.2 63.26,50.42 62.18,51.5 62.23,51.56 62.23,52.96 64.77,55.5 64.77,59.18 64.77,59.18
  Bottom Layer w0.254: U1.4 12.61,57.66 14.35,57.66 16,59.31 U1.2
  Bottom Layer w0.508: 54.61,59.18 56.39,60.96 62.99,60.96 64.77,59.18
1B: length 32.7
  Bottom Layer w0.254: U3.2 33.91,51.82 35.69,53.59 62.74,53.59 64.77,51.56
1CK2: length 45.5
  Top Layer w0.254: J3.2 56.26,67.52 R8.2 ; J3.20 58.42,67.92 58.42,53.21 59.69,51.94 59.69,51.56
2CK2: length 40.9
  Top Layer w0.254: 62.23,59.18 62.23,60.71 63,61.47 69.47,61.47 70.23,62.23 70.23,67.59 ; J4.2 70.23,67.76 70.4,67.59
2CLR: length 70.2
  Top Layer w0.254: K11.3 K11.4 47.89,5.97 50.04,5.97 51.18,7.11 51.18,38.1 54.76,41.68 57.27,41.68 ; U2.13 57.15,55.94 55.92,54.71 55.92,49 R10.1 57.42,44.7 ; 57.45,44.7 57.45,41.79 C7.1
2D: length 11.7
  Bottom Layer w0.254: U1.5 8.42,56.46 9.01,55.87 12.34,55.87 13.5,54.7 U1.12
K1: length 108.8
  Top Layer w0.254: NOREF.30 23.24,38.97 K2.1 K2.2
  Bottom Layer w0.254: NOREF.30 21.21,44.96 21.21,86.74 J1.3 26.04,91.57 38.35,91.57 39.5,90.42 39.75,90.42 ; J2.3 41.01,91.56 52.56,91.56 J3.3 54.99,91.67 66.46,91.67 67.69,90.44 J4.3
VO: length 77.4
  Top Layer w0.254: 67.31,59.18 68.96,60.83 71.5,60.83 72.39,59.94 72.39,39.57 71.43,38.61
  Bottom Layer w0.254: U3.1 29.34,53.58 29.34,60.33 31.12,62.1 64.39,62.1 67.31,59.18
$1N2580: length 3.1
  Top Layer w0.254: D1.1 6.75,73.26 9.85,73.26
$1N2943: length 12.9
  Top Layer w0.254: 70.92,47.33 71.63,48.03 71.63,57.4 69.85,59.18
$1N4176: length 178.7
  Top Layer w0.254: 7.95,6.14 6.22,7.87 6.22,13.9 K7.3 ; K1.4 K1.3 6.22,32.91 6.22,26.56 K4.3 6.22,23.47 6.22,17.25 K7.3 ; K1.4 16.87,35.54 19.3,37.97 19.3,43.18 18.16,44.32 12.56,44.32 ; K1.4 K2.3 ; 7.77,24.93 16.78,24.93 K4.4 23.26,25.01 ; K7.3 16.89,15.57 17,15.46 ; 7.87,6.22 8.03,6.07 17,6.07 ; 17,15.67 17.27,15.4 K8.3 K8.4 38.64,15.4 38.74,15.49 ; 23.34,34.45 K2.4 38.66,34.45 38.76,34.36 47.76,34.36 K3.4 ; K5.4 23.34,24.93 ; 32.45,24.93 38.72,24.93 K6.3 K6.4 ; K9.4 38.74,15.49
$1N5266: length 4.9
  Top Layer w0.254: Q1.1 69.24,38.57 69.28,38.61
$1N5277: length 8.5
  Top Layer w0.254: D2.1 67.76,9.27
$1N5285: length 22.1
  Top Layer w0.254: R4.2 72.14,11.57 72.14,27.2 K12.3
$1N5293: length 6
  Top Layer w0.254: 57.64,29.5 57.64,33 58.17,33.53 D3.1
$1N5296: length 20.3
  Top Layer w0.254: 55.64,23.5 62.73,23.5 63.5,24.26 63.5,33.54 ; Q1.3 63.5,33.54 ; 63.5,33.54 D3.2

## Copper pours and planes (outline as drawn; the poured copper is in the pictures)
GND on Top Layer: 0,99.82 79.88,99.82 79.88,0 0,0
GND on Bottom Layer: 0,99.82 79.88,99.82 79.88,0 0,0

## Text on the board
Top Silkscreen Layer: NUEDC创新实验室 马誉轩 230910221 | 编码电子锁
